# EAGLE schematic FeatherwingCircuitDual autofocus (EAGLE 9.2.2)
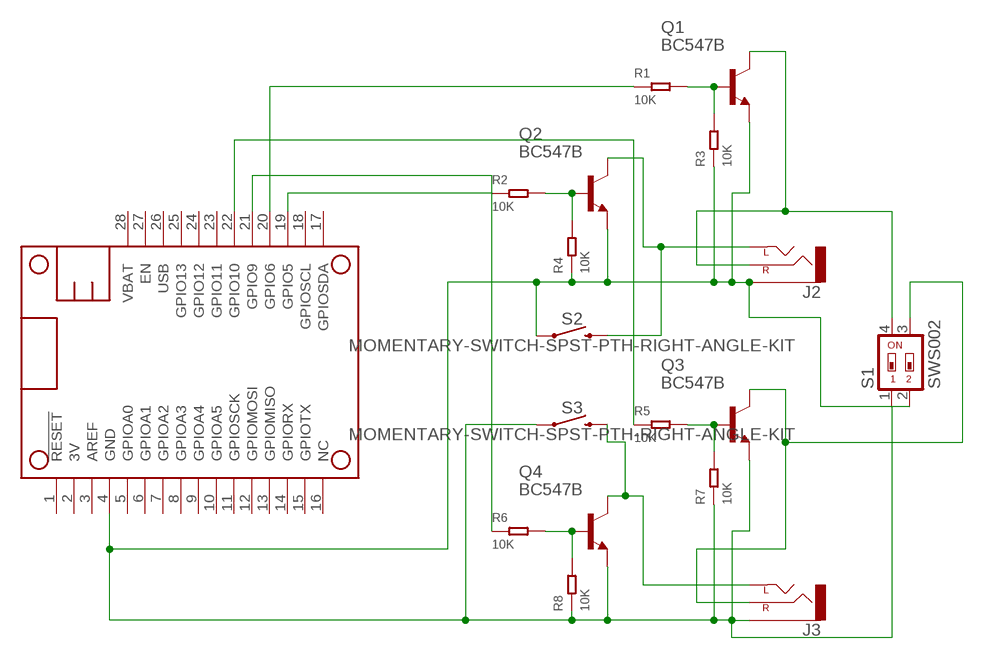
[diagram p0: schematic, sheet 1]

## Parts
J2  AUDIO_JACK_2.5MM_2.5MM  [STEREOJACK2.5MM_STEREOJACK2.5MM]
J3  AUDIO_JACK_2.5MM_2.5MM  [STEREOJACK2.5MM_STEREOJACK2.5MM]
MS1  FEATHERWING_NODIM  [FEATHERWING_DIM]
Q1  BC547B  [TO92]
Q2  BC547B  [TO92]
Q3  BC547B  [TO92]
Q4  BC547B  [TO92]
R1  10K  DIP-RES-10K-5%-1/4W(PR-D2.3XL6.5MM)  [PR-D2.3XL6.5MM]
R2  10K  DIP-RES-10K-5%-1/4W(PR-D2.3XL6.5MM)  [PR-D2.3XL6.5MM]
R3  10K  DIP-RES-10K-5%-1/4W(PR-D2.3XL6.5MM)  [PR-D2.3XL6.5MM]
R4  10K  DIP-RES-10K-5%-1/4W(PR-D2.3XL6.5MM)  [PR-D2.3XL6.5MM]
R5  10K  DIP-RES-10K-5%-1/4W(PR-D2.3XL6.5MM)  [PR-D2.3XL6.5MM]
R6  10K  DIP-RES-10K-5%-1/4W(PR-D2.3XL6.5MM)  [PR-D2.3XL6.5MM]
R7  10K  DIP-RES-10K-5%-1/4W(PR-D2.3XL6.5MM)  [PR-D2.3XL6.5MM]
R8  10K  DIP-RES-10K-5%-1/4W(PR-D2.3XL6.5MM)  [PR-D2.3XL6.5MM]
S1  SWS002  [SMS-002]
S2  MOMENTARY-SWITCH-SPST-PTH-RIGHT-ANGLE-KIT  [TACTILE_SWITCH_PTH_RIGHT_ANGLE_KIT]
S3  MOMENTARY-SWITCH-SPST-PTH-RIGHT-ANGLE-KIT  [TACTILE_SWITCH_PTH_RIGHT_ANGLE_KIT]

## Nets
GND: J2.RING1(SLEEVE) J3.RING1(SLEEVE) MS1.4(GND) Q1.1(E) Q2.1(E) Q3.1(E) Q4.1(E) R3.1 R4.1 R7.1 R8.1 S1.1 S1.2 S2.1 S3.1
N$1: Q1.2(B) R1.2 R3.2
N$2: Q2.2(B) R2.2 R4.2
N$3: J2.TIP(RIGHT) Q1.3(C) S1.4
N$4: J2.SHIELD(LEFT) Q2.3(C) S2.2
N$5: Q3.2(B) R5.2 R7.2
N$6: MS1.19(GPIO5) R2.1
N$7: MS1.20(GPIO6) R1.1
N$8: Q4.2(B) R6.2 R8.2
N$9: J3.TIP(RIGHT) Q3.3(C) S1.3
N$10: J3.SHIELD(LEFT) Q4.3(C) S3.2
N$11: MS1.21(GPIO9) R6.1
N$12: MS1.22(GPIO10) R5.1
Unconnected: MS1.1(!RESET) MS1.2(3V) MS1.3(AREF) MS1.5(GPIOA0) MS1.6(GPIOA1) MS1.7(GPIOA2) MS1.8(GPIOA3) MS1.9(GPIOA4) MS1.10(GPIOA5) MS1.11(GPIOSCK) MS1.12(GPIOMOSI) MS1.13(GPIOMISO) MS1.14(GPIORX) MS1.15(GPIOTX) MS1.16(NC) MS1.17(GPIOSDA) MS1.18(GPIOSCL) MS1.23(GPIO11) MS1.24(GPIO12) MS1.25(GPIO13) MS1.26(USB) MS1.27(EN) MS1.28(VBAT)

## Library data of the parts
J2 J3 = SparkFun-Connectors:AUDIO_JACK_2.5MM: Audio Jack 2.5mm variants of PTH and SMT audio jacks. SparkFun Products: SparkFun PicoBoard <https://www.sparkfun.com/products/11888>- 2.5mm SMD; PROD_ID: CONN-09878
MS1 = adafruit:FEATHERWING
Q1-Q4 = transistor-npn:BC547*: NPN Transistor
R1-R8 = Seeed-Resistor:DIP-RES-10K-5%-1/4W(PR-D2.3XL6.5MM): 301020001; MPN: FHCFR-1/4W-103J
S1 = smd-special:SWS002: SMD Dip Switch 2 pol.
S2 S3 = SparkFun-Switches:MOMENTARY-SWITCH-SPST: Momentary Switch (Pushbutton) - SPST Normally-open (NO) SPST momentary switches (buttons, pushbuttons). Variants PTH-12MM - 12mm square, through-hole Momentary Pushbutton Switch - 12mm Square <https://www.sparkfun.com/products/9190> (COM-09190) PTH-6.0MM, PTH-6.0MM-KIT - 6.0mm square, through-hole Mini Pushbutton Switch <https://www.sparkfun.com/products/97> (COM-00097) KIT package intended for soldering kit's - only one side of pads' copper is exposed. PTH-RIGHT-ANGLE-KIT - Right-angle, through-hole Right Angle Tactile Button <https://www.sparkfun.com/products/10791> - Used on SparkFun BigTime Watch Kit <https://www.sparkfun.com/products/11734> SMD-12MM - 12mm square, surface-mount Tactile Button - SMD (12mm) <https://www.sparkfun.com/products/12993> (COM-12993) Used on SparkFun PicoBoard <https://www.sparkfun.com/products/11888> SMD-4.5MM - 4.5mm Square Trackball Switch Used on SparkFun Blackberry Trackballer Breakout <https://www.sparkfun.com/products/13169> SMD-4.6MMX2.8MM - 4.60mm x 2.80mm, surface mount Used on SparkFun SAMD21 Mini Breakout <https://www.sparkfun.com/products/13664> SMD-5.2MM, SMD-5.2-REDUNDANT - 5.2mm square, surface-mount Mini Pushbutton Switch - SMD <https://www.sparkfun.com/products/8720> (COM-08720) Used on Arduino Pro Mini <https://www.sparkfun.com/products/11114> REDUNDANT package connects both switch circuits together SMD-6.0X3.5MM - 6.0 x 3.5mm, surface mount Momentary Reset Switch SMD <https://www.sparkfun.com/products/8229> (COM-08229) SMD-6.2MM-TALL - 6.2mm square, surface mount Tactile Button - SMD (6mm) <https://www.sparkfun.com/products/12992> Used on SparkFun Digital Sandbox <https://www.sparkfun.com/products/12651> SMD-RIGHT-ANGLE - Right-angle, surface mount Used on SparkFun Block for Intel® Edison - Arduino <https://www.sparkfun.com/products/13036>; PROD_ID: CONN-10672; SF_SKU: COM-10791